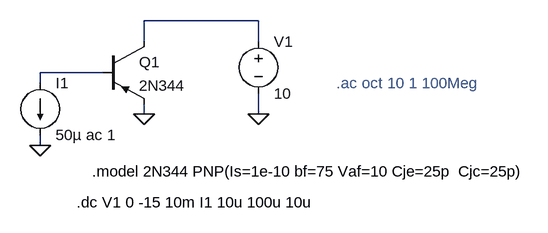
[diagram p0: schematic 2N344.asc]
2N344.asc, the LTspice schematic file:
Version 4
SHEET 1 948 680
WIRE 336 176 160 176
WIRE 160 208 160 176
WIRE 336 208 336 176
WIRE 96 256 0 256
WIRE 0 272 0 256
WIRE 160 320 160 304
WIRE 336 320 336 288
WIRE 0 368 0 352
FLAG 336 320 0
FLAG 160 320 0
FLAG 0 368 0
SYMBOL pnp 96 208 R0
SYMATTR InstName Q1
SYMATTR Value 2N344
SYMBOL voltage 336 192 R0
SYMATTR InstName V1
SYMATTR Value 10
SYMBOL current 0 272 R0
SYMATTR InstName I1
SYMATTR Value 50µ ac 1
TEXT 56 456 Left 2 !.dc V1 0 -15 10m I1 10u 100u 10u
TEXT 80 408 Left 2 !.model 2N344 PNP(Is=1e-10 bf=75 Vaf=10 Cje=25p  Cjc=25p)
TEXT 456 272 Left 2 ;.ac oct 10 1 100Meg

The netlist it stands for:
* 2N344.asc
Q1 N001 N002 0 0 2N344
V1 N001 0 10
I1 N002 0 50µ ac 1
.model NPN NPN
.model PNP PNP
.lib standard.bjt
.dc V1 0 -15 10m I1 10u 100u 10u
.model 2N344 PNP(Is=1e-10 bf=75 Vaf=10 Cje=25p  Cjc=25p)
* .ac oct 10 1 100Meg
.backanno
.end